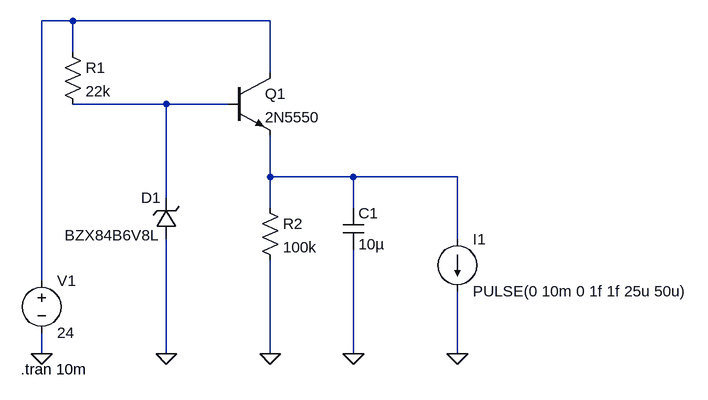
[diagram p0: schematic Sec_Linear_Regulator.asc]
Sec_Linear_Regulator.asc, the LTspice schematic file:
Version 4
SHEET 1 1004 680
WIRE 32 -288 -16 -288
WIRE 336 -288 32 -288
WIRE 32 -240 32 -288
WIRE 336 -208 336 -288
WIRE 176 -160 32 -160
WIRE 272 -160 176 -160
WIRE 336 -48 336 -112
WIRE 464 -48 336 -48
WIRE 624 -48 464 -48
WIRE 176 -16 176 -160
WIRE 336 0 336 -48
WIRE 464 0 464 -48
WIRE 624 48 624 -48
WIRE -16 112 -16 -288
WIRE -16 224 -16 192
WIRE 176 224 176 48
WIRE 336 224 336 80
WIRE 464 224 464 64
WIRE 624 224 624 128
FLAG -16 224 0
FLAG 176 224 0
FLAG 336 224 0
FLAG 624 224 0
FLAG 464 224 0
SYMBOL voltage -16 96 R0
WINDOW 123 0 0 Left 0
WINDOW 39 0 0 Left 0
SYMATTR InstName V1
SYMATTR Value 24
SYMBOL npn 272 -208 R0
SYMATTR InstName Q1
SYMATTR Value 2N5550
SYMBOL res 16 -256 R0
SYMATTR InstName R1
SYMATTR Value 22k
SYMBOL zener 192 48 R180
WINDOW 0 24 64 Left 2
WINDOW 3 27 6 Left 2
SYMATTR InstName D1
SYMATTR Value BZX84B6V8L
SYMATTR Description Diode
SYMATTR Type diode
SYMBOL res 320 -16 R0
SYMATTR InstName R2
SYMATTR Value 100k
SYMBOL current 624 48 R0
WINDOW 123 0 0 Left 0
WINDOW 39 0 0 Left 0
SYMATTR InstName I1
SYMATTR Value PULSE(0 10m 0 1f 1f 25u 50u)
SYMBOL cap 448 0 R0
SYMATTR InstName C1
SYMATTR Value 10µ
TEXT -48 248 Left 2 !.tran 10m

The netlist it stands for:
* Sec_Linear_Regulator.asc
V1 N001 0 24
Q1 N001 N002 N003 0 2N5550
R1 N001 N002 22k
D1 0 N002 BZX84B6V8L
R2 N003 0 100k
I1 N003 0 PULSE(0 10m 0 1f 1f 25u 50u)
C1 N003 0 10µ
.model D D
.lib standard.dio
.model NPN NPN
.model PNP PNP
.lib standard.bjt
.tran 10m
.backanno
.end